# Altium project DSpico.PrjPcb
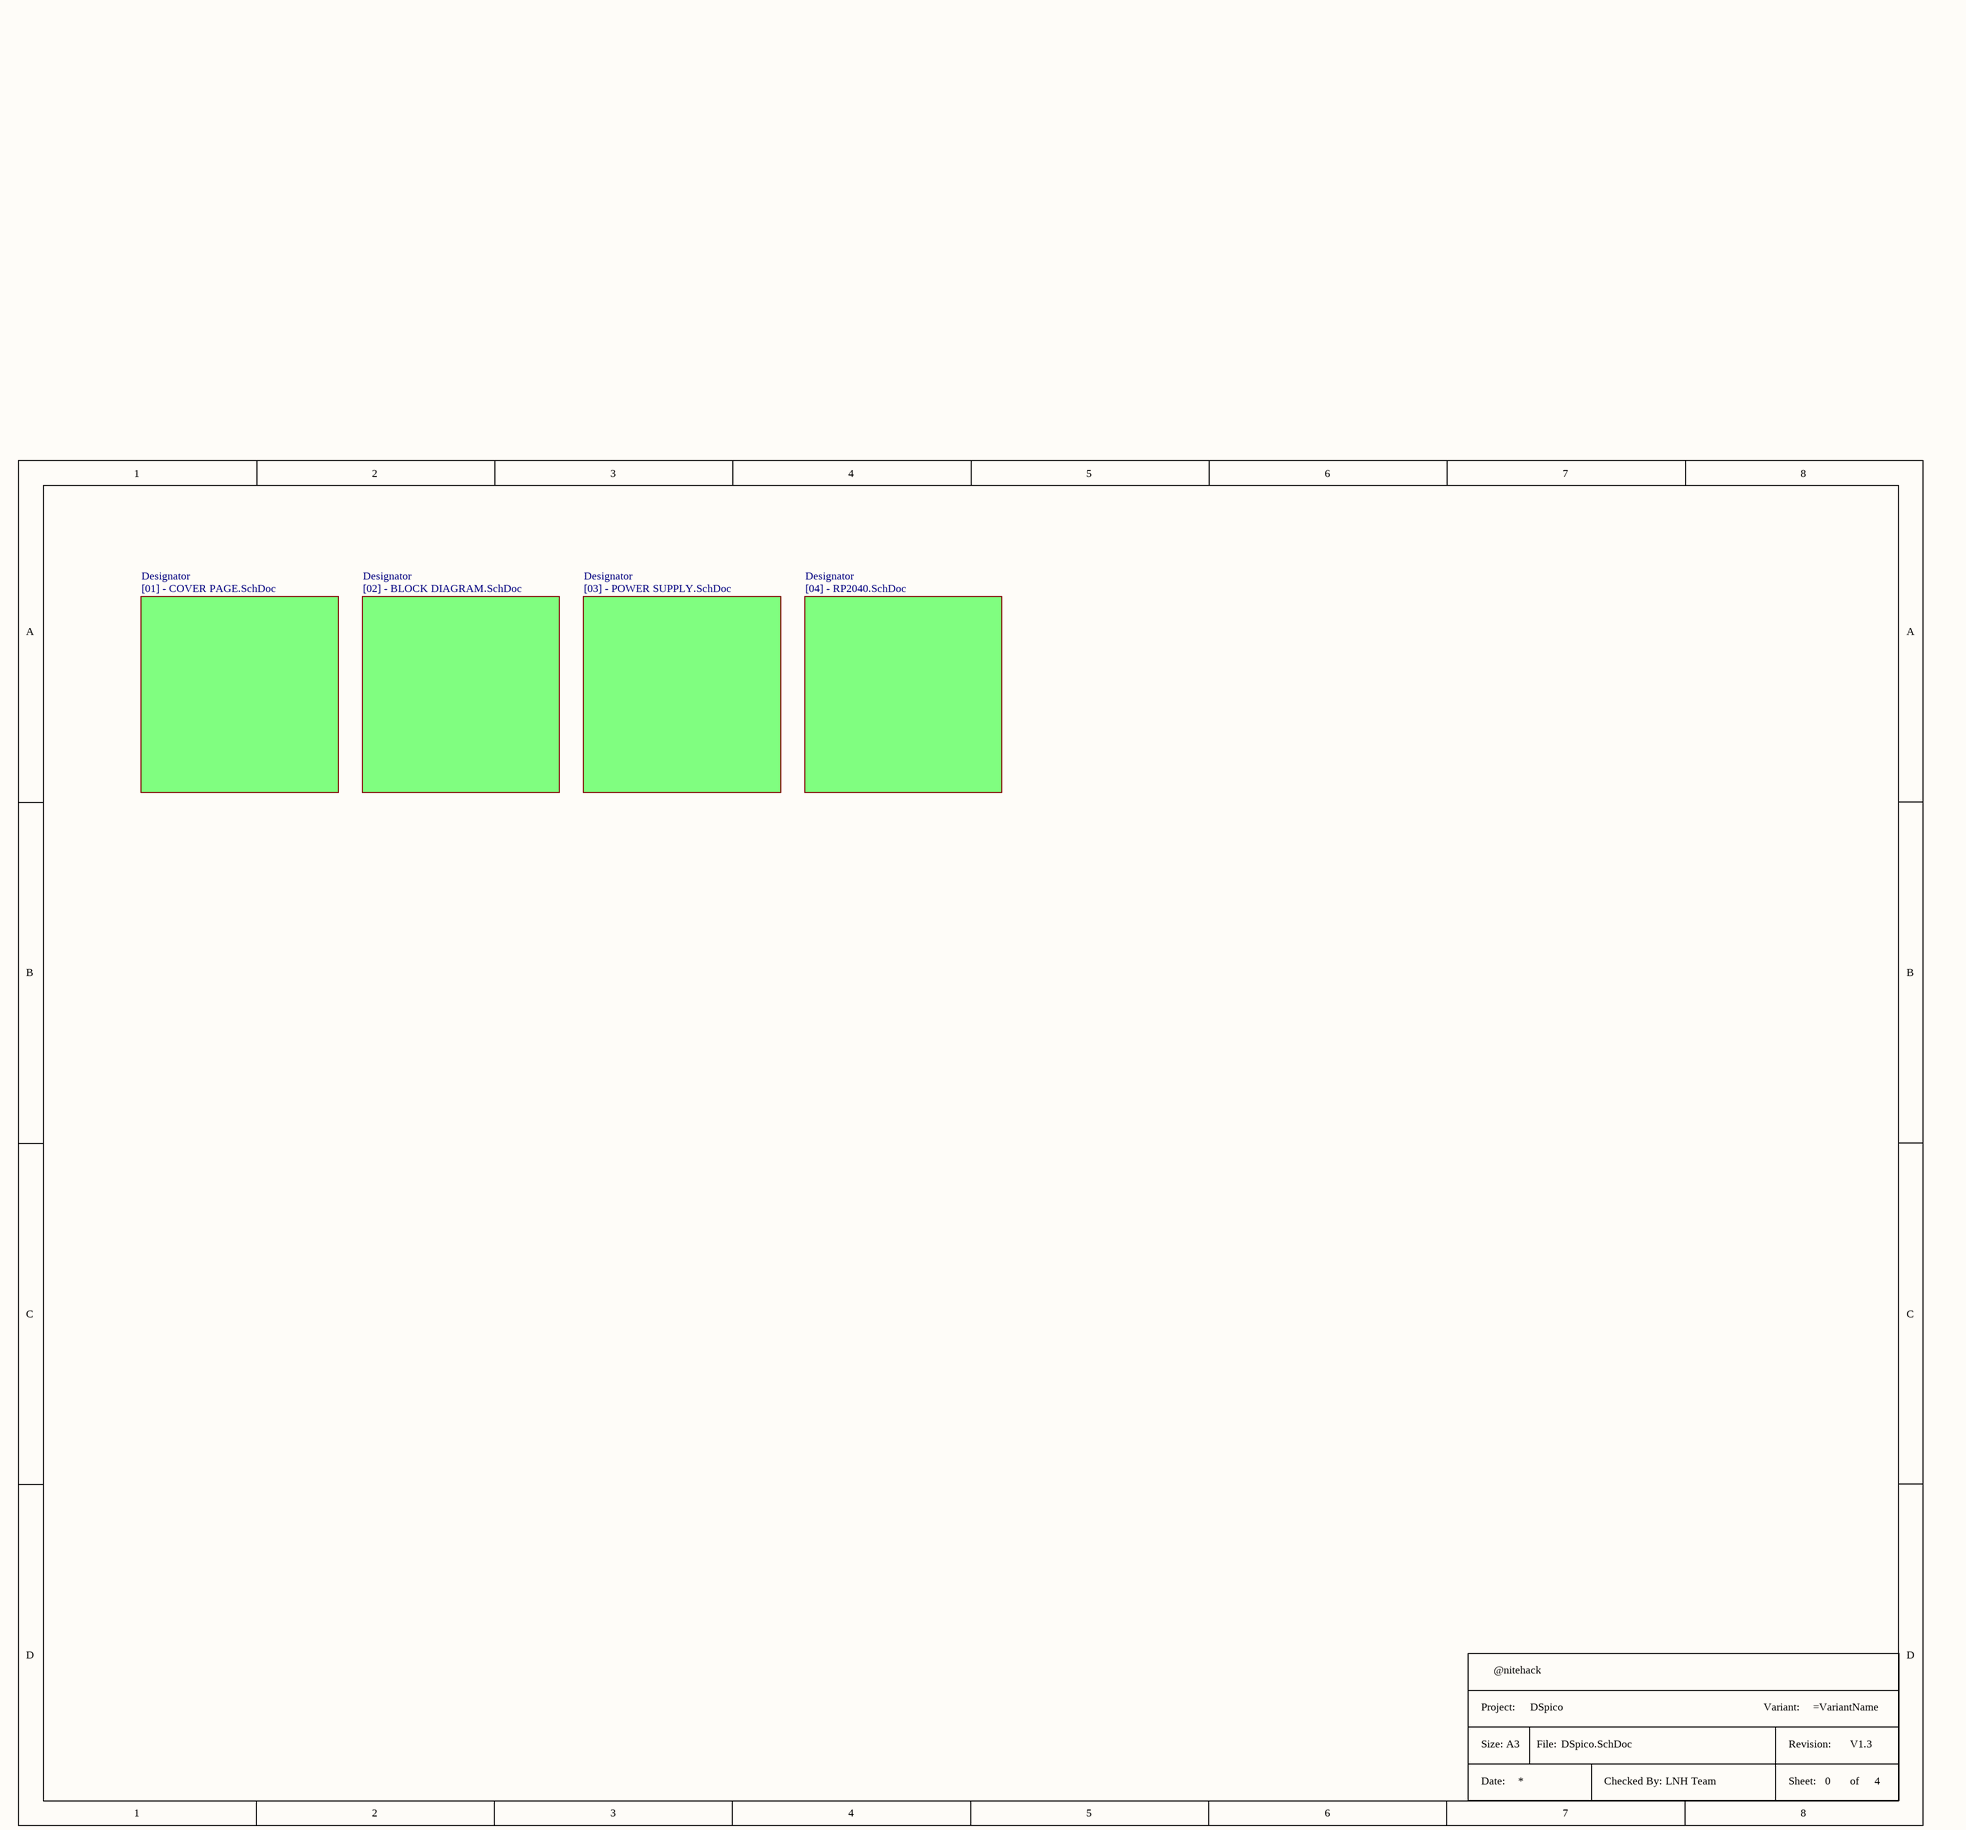
[diagram p0: DSpico.SchDoc]
CheckedBy: LNH Team; Year: 2024; VersionRevision: V1.3; Project: DSpico; Company: @nitehack
5 sheets, 49 parts. Net scope: global (net labels, ports and power ports of the same name join across sheets).
Board file: DSpico_PCB.PcbDoc
Sheets:
  DSpico.SchDoc
    Designator = [01] - COVER PAGE.SchDoc
    Designator = [03] - POWER SUPPLY.SchDoc
    Designator = [02] - BLOCK DIAGRAM.SchDoc
    Designator = [04] - RP2040.SchDoc

## Sheet DSpico.SchDoc
size A3; CompanyName: KDS; Organization: KDS; DocumentNumber: 0; Revision: V1I1; SheetNumber: 0; SheetTotal: 4; PageSetup: Record=PageOptions|CenterHorizontal=True|CenterVertical=True|PrintScale=1.07|XCorrection=1.00|YCorrection=1.00|PrintKind=1|BorderSize=5000000|LeftOffset=0|BottomOffset=0|Orientation=2|PaperLength=1000|PaperWidth=1000|Scale=100|PaperSource=7|PrintQuality=600|MediaType=1|DitherType=10|PaperKind=A3|PrintScaleMode=1; ProjectName: KDS C6A816x Module

### Parts
(Parts that share a designator on the sheet are numbered #1, #2 ... from top to bottom, then left to right.)
*#1  Title Block A3  (value not drawn)  (graphical)

### Sub-sheets
Designator = [01] - COVER PAGE.SchDoc: no entries
Designator = [03] - POWER SUPPLY.SchDoc: no entries
Designator = [02] - BLOCK DIAGRAM.SchDoc: no entries
Designator = [04] - RP2040.SchDoc: no entries

### Notes on the sheet
- (in symbol Title Block A3) Project:; Variant:; Size: A3; File:; Revision:; Date:; Checked By:; Sheet:; of

## Sheet [01] - COVER PAGE.SchDoc
size A3; DocumentNumber: 1; SheetNumber: 1; SheetTotal: 4
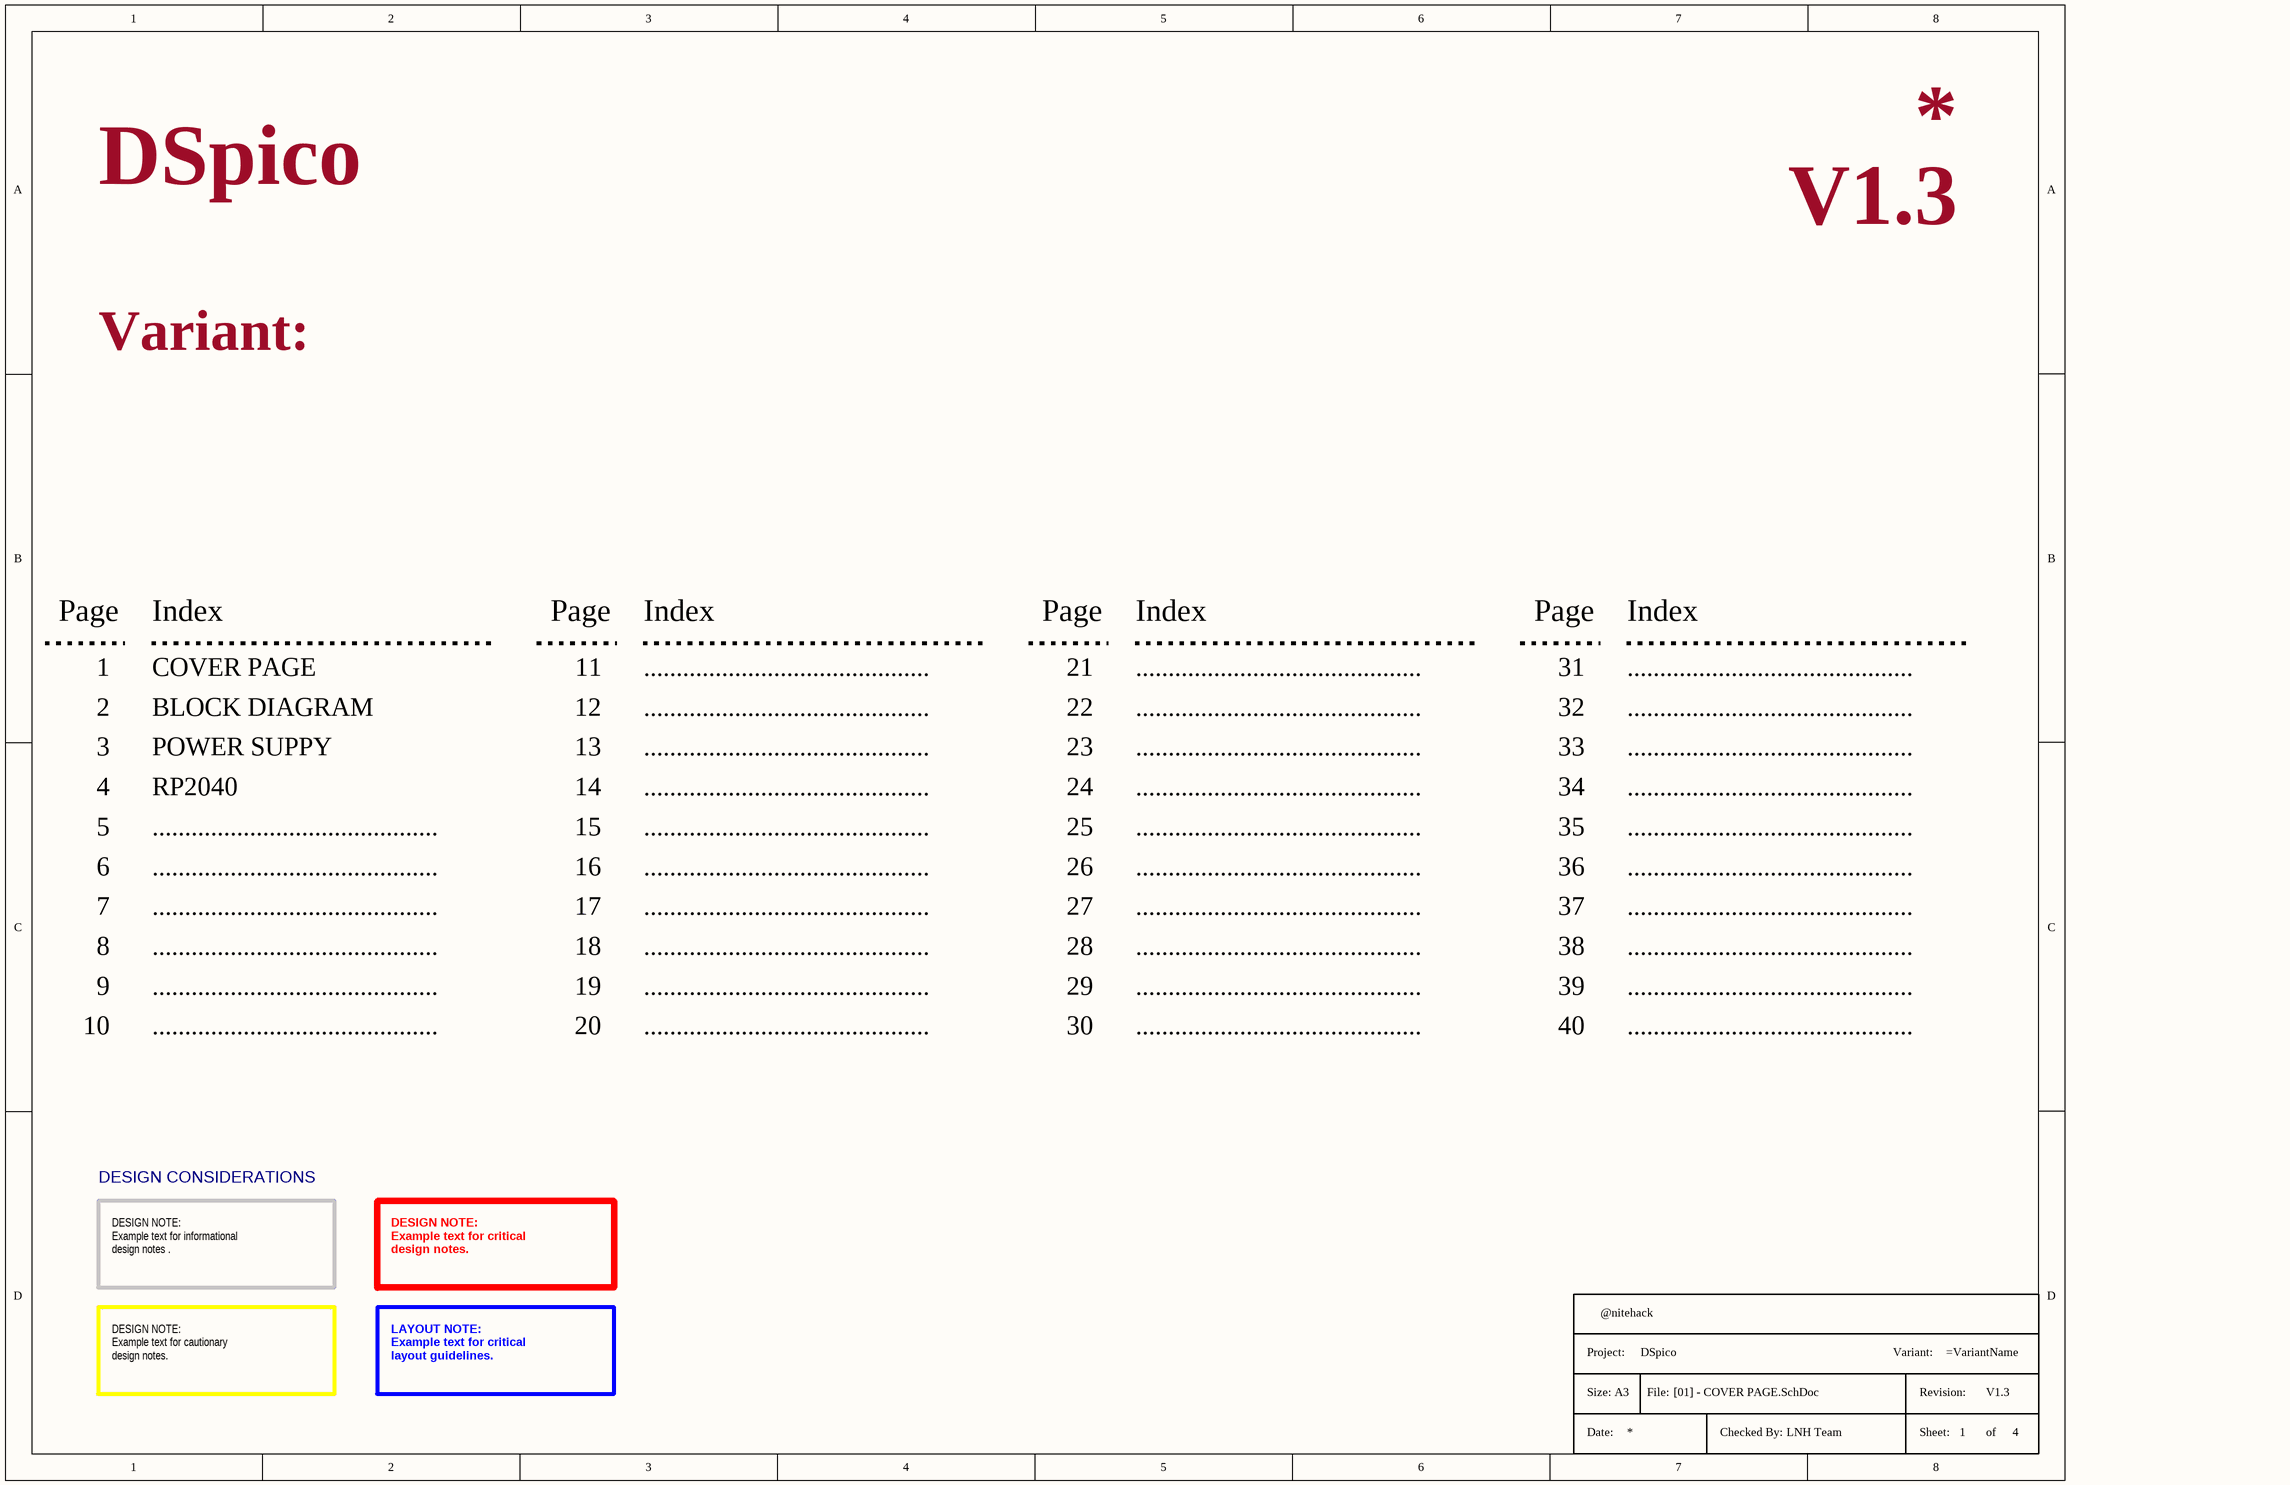
[diagram p1: [01] - COVER PAGE.SchDoc]

### Parts
(Parts that share a designator on the sheet are numbered #1, #2 ... from top to bottom, then left to right.)
*#2  Title Block A3  (value not drawn)  (graphical)

### Notes on the sheet
- Variant:
- Page
- Index
- 1
- COVER PAGE
- 11
- ............................................
- 21
- 31
- 2
- 3
- BLOCK DIAGRAM
- POWER SUPPY
- 12
- 13
- 22
- 23
- 32
- 33
- 4
- 5
- RP2040
- 14
- 15
- 24
- 25
- 34
- 35
- 6
- 16
- 26
- 36
- 7
- 8
- 17
- 18
- 27
- 28
- 37
- 38
- 9
- 10
- 19
- 20
- 29
- 30
- 39
- 40
- DESIGN CONSIDERATIONS
- DESIGN NOTE:
  Example text for informational
  design notes .
- DESIGN NOTE:
  Example text for critical
  design notes.
- DESIGN NOTE:
  Example text for cautionary
  design notes.
- LAYOUT NOTE:
  Example text for critical
  layout guidelines.
- (in symbol Title Block A3) Project:; Variant:; Size: A3; File:; Revision:; Date:; Checked By:; Sheet:; of

## Sheet [03] - POWER SUPPLY.SchDoc
size A4; DocumentNumber: 3; SheetNumber: 3; SheetTotal: 4
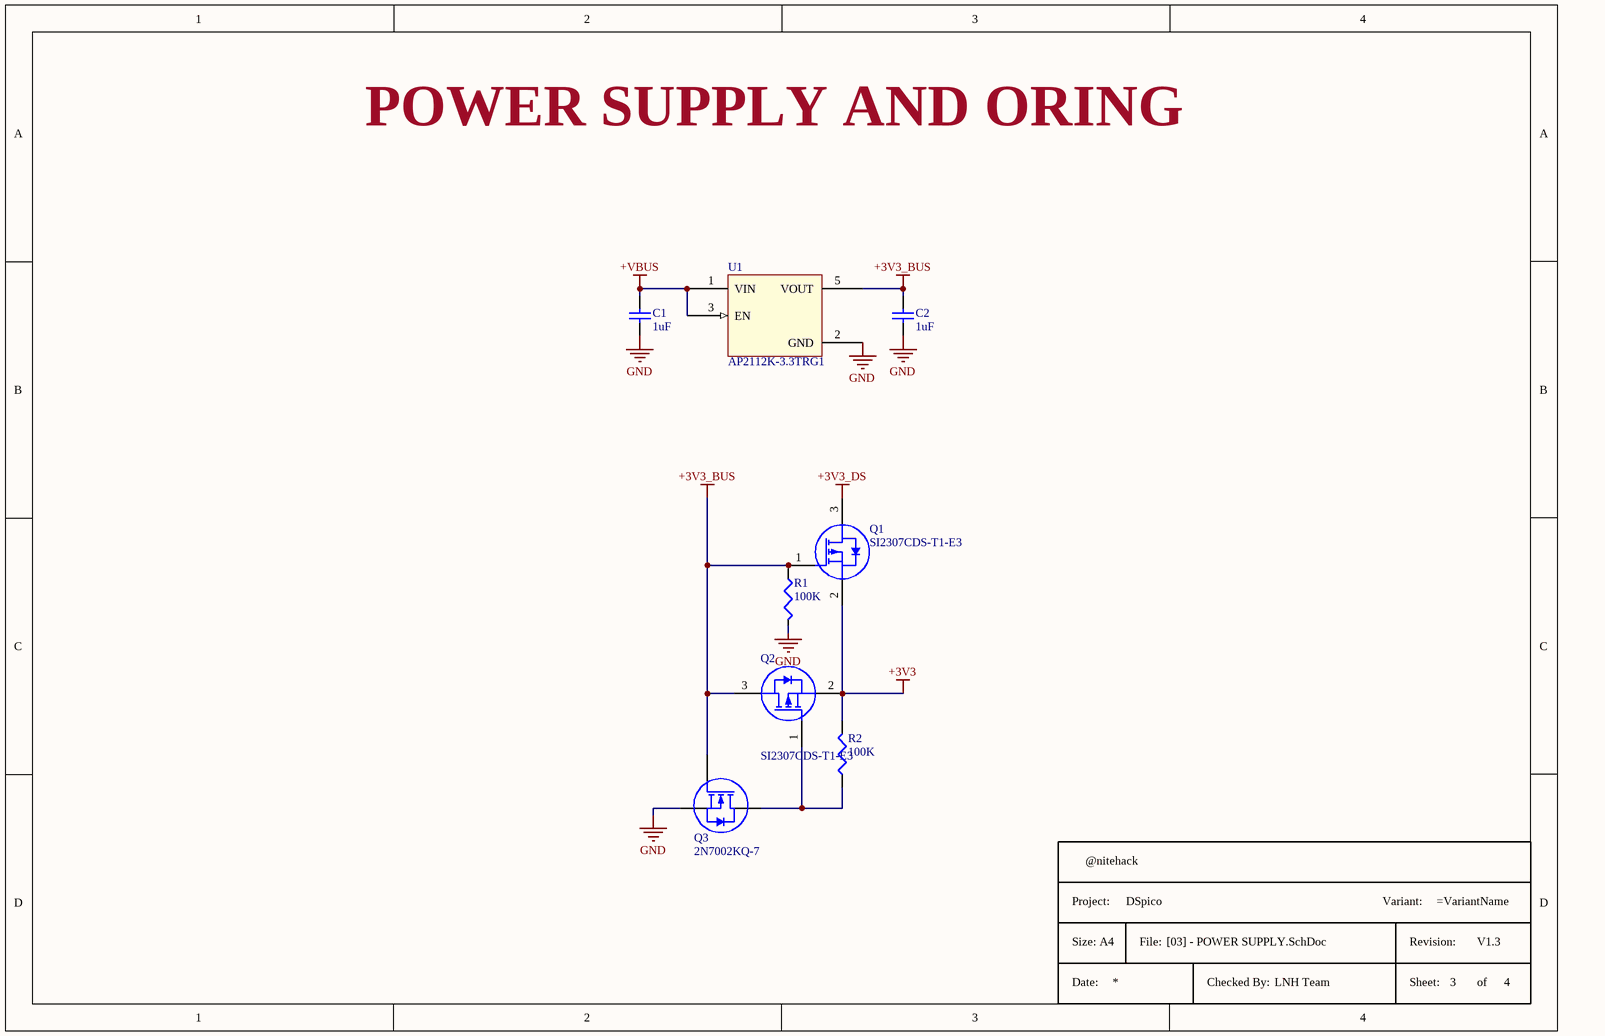
[diagram p2: [03] - POWER SUPPLY.SchDoc]

### Parts
*?  Title Block A4  (value not drawn)  (graphical)
C1  1uF  [C0402]
C2  1uF  [C0402]
Q1  SI2307CDS-T1-E3  [SOT-23_L2.9-W1.3-P1.90-LS2.4-BR]
Q2  SI2307CDS-T1-E3  [SOT-23_L2.9-W1.3-P1.90-LS2.4-BR]
Q3  2N7002KQ-7  [SOT-23_L2.9-W1.3-P1.90-LS2.4-BR]
R1  100K  [R0402]
R2  100K  [R0402]
U1  AP2112K-3.3TRG1  [SOT95P285X140-5N]

### Nets
+3V3: Q1.2(S) Q2.2(S) R2.2
+3V3_BUS: C2.2 Q1.1(G) Q2.3(D) Q3.1(G) R1.1 U1.5(VOUT)
+3V3_DS: Q1.3(D)
+VBUS: C1.2 U1.1(VIN) U1.3(EN)
GND: C1.1 C2.1 Q3.2(S) R1.2 U1.2(GND)
NetQ2_1: Q2.1(G) Q3.3(D) R2.1

### Notes on the sheet
- POWER SUPPLY AND ORING
- (in symbol Title Block A4) Project:; Variant:; Size: A4; File:; Revision:; Date:; Checked By:; Sheet:; of

### Library data of the parts
C1 C2 = C1005X5R1E105K050BC: TDK - C1005X5R1E105K050BC - COND, CERÁ MULT, X5R, 1UF, 25V, 0402; Dielectric Material: Ceramic; Tolerance: 10%; Supplier 1: Farnell; Supplier Part Number 1: 2346884; RoHS: YES; Stock: 131328; Pricing: 10=0,0948, 100=0,0638, 500=0,0468, 2500=0,0336, 5000=0,028, 10000=0,021, 50000=0,0175, 100000=0,0153 (EUR); ComponentLink1URL: http://www.farnell.com/datasheets/1796654.pdf; ComponentLink1Description: http://www.farnell.com/datasheets/1796654.pdf; .PCBCheck: *; .SCHCheck: *; Supplier 2: RSComponents; Supplier 3: Mouser; Supplier 4: Digi-Key; Supplier Part Number 2: 1110310; Supplier Part Number 3: 810-C1005X5R1E105K; Supplier Part Number 4: 445-9066-1-ND; Storage Location: C1-F2; Manufacturer: TDK; Manufacturer Part Number: C1005X5R1E105K050BC; Mount: Surface Mount; Case/Package: 0402; Weight: 2.3E-05oz; Case Code (Metric): 1005; Case Code (Imperial): 0402; Min Operating Temperature: -55°C; Max Operating Temperature: 85°C; Packaging: Tape and Reel; Capacitance: 1uF; Voltage Rating: 25V; Termination: SMD/SMT; Package Quantity: 1; Voltage Rating (DC): 25V; Dielectric: X5R; Composition: Ceramic; Length: 1mm; Height: 0.5mm; Width: 0.02inch; Thickness: 0.022inch; Depth: 0.5mm; Radiation Hardening: No; REACH SVHC: No SVHC; Lead Free: Lead Free
Q1 Q2 = SI2307CDS-T1-E3: P-Channel 30 V 3.5A (Tc) 1.1W (Ta), 1.8W (Tc) Surface Mount SOT-23-3 (TO-236); Number of Elements: 1; Package Body Material: Plastic; JEDEC-95 Code: TO-236AB; Transistor Application: SWITCHING; FET Technology: METAL-OXIDE SEMICONDUCTOR; Drain-source On Resistance-Max: 88mR; DS Breakdown Voltage-Min: 30V; Qualification Status: Not Qualified; Transistor Element Material: SILICON; Operating Mode: ENHANCEMENT MODE; Time @ Peak Reflow Temperature-Max (s): 30s; JESD-30 Code: R-PDSO-G3; Moisture Sensitivity Level: 1; Terminal Finish: Tin; Max Operating Temperature: 150°C; Power Dissipation-Max (Abs): 1.8W; Package Shape: Rectangular; Surface Mount: Yes; Case/Package: SOT23-3; JESD-609 Code: e3; Polarity/Channel Type: P-CHANNEL; Peak Reflow Temperature (Cel): 260°C; Terminal Position: DUAL; Drain Current-Max (Abs) (ID): 3.5A; REACH SVHC: Yes; RoHS Compliant: Yes; Package Style: SMALL OUTLINEMeter; Number of Pins: 3; Drain Current-Max (ID): 3.5A; Terminal Form: Gull Wing; Value: SI2307CDS-T1-E3
Q3 = 2N7002KQ-7: MOSFETs SOT-23; Manufacturer: Diodes Zetex; Rise Time: 3.4ns; Continuous Drain Current (ID): 380mA; Number of Elements: 1; Power Dissipation: 540mW; Turn-On Delay Time: 3.9ns; Turn-Off Delay Time: 15.7ns; Fall Time: 9.9ns; Gate to Source Voltage (Vgs): 20V; Supplier 1: Arrow Electronics; Manufacturer Part Number: 2N7002KQ-7; RoHS: Yes; Category: MOSFETs; Stock 1: 3000; Pricing 1: 1=0,05830, 10=0,05770, 25=0,05710, 100=0,05650, 250=0,05600, 500=0,05540, 1000=0,05490, 3000=0,02680 (USD); Mount: Surface Mount; Case/Package: SOT-23; Number of Pins: 3; Contact Plating: Tin,Matte; Min Operating Temperature: -55°C; Max Operating Temperature: 150°C; Packaging: Tape and Reel; Radiation Hardening: No; Reach SVHC Compliant: Yes; RoHS Compliant: Yes; ComponentLink1URL: https://datasheet.ciiva.com/30023/ds30896-30023832.pdf?src-supplier=Avnet; ComponentLink1Description: https://datasheet.ciiva.com/30023/ds30896-30023832.pdf?src-supplier=Avnet; Supplier Part Number 1: 2N7002KQ-7
R1 R2 = CRCW0402100KFKED: RES SMD 100K OHM 1% 1/16W 0402; Manufacturer: Vishay; Resistance: 100kR; Temperature Coefficient: 100ppm/°C; Power Rating: 63mW; Voltage Rating: 50V; Supplier 1: Farnell; Manufacturer Part Number: CRCW0402100KFKED; Stock 1: 168772; Pricing 1: 10=0.0216, 100=0.0151, 500=0.0077, 2500=0.0058, 5000=0.0046 (GBP); Mount: Surface Mount; Case/Package: 0402; Number of Pins: 2; Weight: 2.3E-05oz; Contact Plating: Tin; Case Code (Metric): 1005; Case Code (Imperial): 0402; Min Operating Temperature: -55°C; Max Operating Temperature: 155°C; Tolerance: 1%; Composition: Thick Film; Termination: SMD/SMT; Packaging: Tape and Reel; Package Quantity: 10000; Number of Terminations: 2; Max Power Dissipation: 63mW; Voltage Rating (DC): 50V; Military Standard: Not; Length: 1mm; Height: 0.35mm; Width: 0.02inch; Depth: 0.5mm; Radiation Hardening: No; Lead Free: Lead Free; REACH SVHC: Unknown; ComponentLink1URL: https://datasheet.ciiva.com/11810/0900766b80d98824-11810752.pdf; ComponentLink1Description: https://datasheet.ciiva.com/11810/0900766b80d98824-11810752.pdf; ComponentLink2URL: https://datasheet.ciiva.com/26316/fld-crcw-e3-data-en-26316630.pdf; ComponentLink2Description: https://datasheet.ciiva.com/26316/fld-crcw-e3-data-en-26316630.pdf; ComponentLink3URL: https://datasheet.ciiva.com/2463/dcrcwe3-2463064.pdf; ComponentLink3Description: https://datasheet.ciiva.com/2463/dcrcwe3-2463064.pdf; ComponentLink4URL: https://datasheet.ciiva.com/2463/dcrcwe3-2463065.pdf; ComponentLink4Description: https://datasheet.ciiva.com/2463/dcrcwe3-2463065.pdf; ComponentLink5URL: https://datasheet.ciiva.com/16776/70201119-16776281.pdf; ComponentLink5Description: https://datasheet.ciiva.com/16776/70201119-16776281.pdf; ComponentLink6URL: https://datasheet.ciiva.com/16941/dcrcwe3-16941129.pdf; ComponentLink6Description: https://datasheet.ciiva.com/16941/dcrcwe3-16941129.pdf; ComponentLink7URL: https://datasheet.ciiva.com/2463/dcrcwe3-2463066.pdf; ComponentLink7Description: https://datasheet.ciiva.com/2463/dcrcwe3-2463066.pdf; ComponentLink8URL: https://datasheet.ciiva.com/3255/dcrcwe3-3255947.pdf; ComponentLink8Description: https://datasheet.ciiva.com/3255/dcrcwe3-3255947.pdf; ComponentLink9URL: https://datasheet.ciiva.com/3255/dcrcwe3-3255948.pdf; ComponentLink9Description: https://datasheet.ciiva.com/3255/dcrcwe3-3255948.pdf; ComponentLink10URL: https://datasheet.ciiva.com/16208/dcrcwe3-16208508.pdf; ComponentLink10Description: https://datasheet.ciiva.com/16208/dcrcwe3-16208508.pdf; ComponentLink11URL: https://datasheet.ciiva.com/5546/dcrcwe3-109170-5546638.pdf; ComponentLink11Description: https://datasheet.ciiva.com/5546/dcrcwe3-109170-5546638.pdf; ComponentLink12URL: https://datasheet.ciiva.com/46441/1720486-46441598.pdf; ComponentLink12Description: https://datasheet.ciiva.com/46441/1720486-46441598.pdf; Supplier Part Number 1: 1469671; Supplier 2: RSComponents; Supplier 3: Mouser; Supplier 4: Digi-Key; Supplier Part Number 2: 6784684; Supplier Part Number 3: 71-CRCW0402-100K-E3; Supplier Part Number 4: 541-100KLCT-ND; Storage Location: C5-K3
U1 = AP2112K-3.3TRG1: IC REG LDO 3.3V 0.6A SOT25; Manufacturer: Diodes; Min Input Voltage: 2.5V; Number of Outputs: 1; Dropout Voltage: 250mV; Max Input Voltage: 6V; Output Current: 600mA; Quiescent Current: 55uA; Polarity: Positive; Accuracy: 1.5%; Output Type: Fixed; Supplier 1: Future Electronics; Manufacturer Part Number: AP2112K-3.3TRG1; RoHS: Yes; Category: Voltage Regulators - Linear; Stock 1: 456000; Pricing 1: 3000=0,12700, 9000=0,12400, 15000=0,12200, 60000=0,11800, 90000=0,11500 (USD); Mount: Surface Mount; Case/Package: SOT-23-5; Number of Pins: 5; Min Operating Temperature: -40°C; Max Operating Temperature: 85°C; Package Quantity: 1; Packaging: Tape and Reel; Output Voltage: 3.3V; Number of Regulators: 1; Max Output Current: 600mA; Length: 3.1mm; Width: 1.7mm; Height: 1.3mm; Lead Free: Lead Free; RoHS Compliant: Yes; ComponentLink1URL: https://datasheet.ciiva.com/30016/ap2112-30016792.pdf?src-supplier=Avnet; ComponentLink1Description: https://datasheet.ciiva.com/30016/ap2112-30016792.pdf?src-supplier=Avnet; ComponentLink2URL: https://datasheet.ciiva.com/29569/ap2112-29569918.pdf?src-supplier=Digi-Key; ComponentLink2Description: https://datasheet.ciiva.com/29569/ap2112-29569918.pdf?src-supplier=Digi-Key; ComponentLink3URL: https://datasheet.ciiva.com/29569/ap2112-29569919.pdf?src-supplier=Digi-Key; ComponentLink3Description: https://datasheet.ciiva.com/29569/ap2112-29569919.pdf?src-supplier=Digi-Key; ComponentLink4URL: https://datasheet.ciiva.com/29569/ap2112-29569917.pdf?src-supplier=Digi-Key; ComponentLink4Description: https://datasheet.ciiva.com/29569/ap2112-29569917.pdf?src-supplier=Digi-Key; Supplier Part Number 1: 8043011

## Sheet [02] - BLOCK DIAGRAM.SchDoc
size A3; DocumentNumber: 2; SheetNumber: 2; SheetTotal: 4
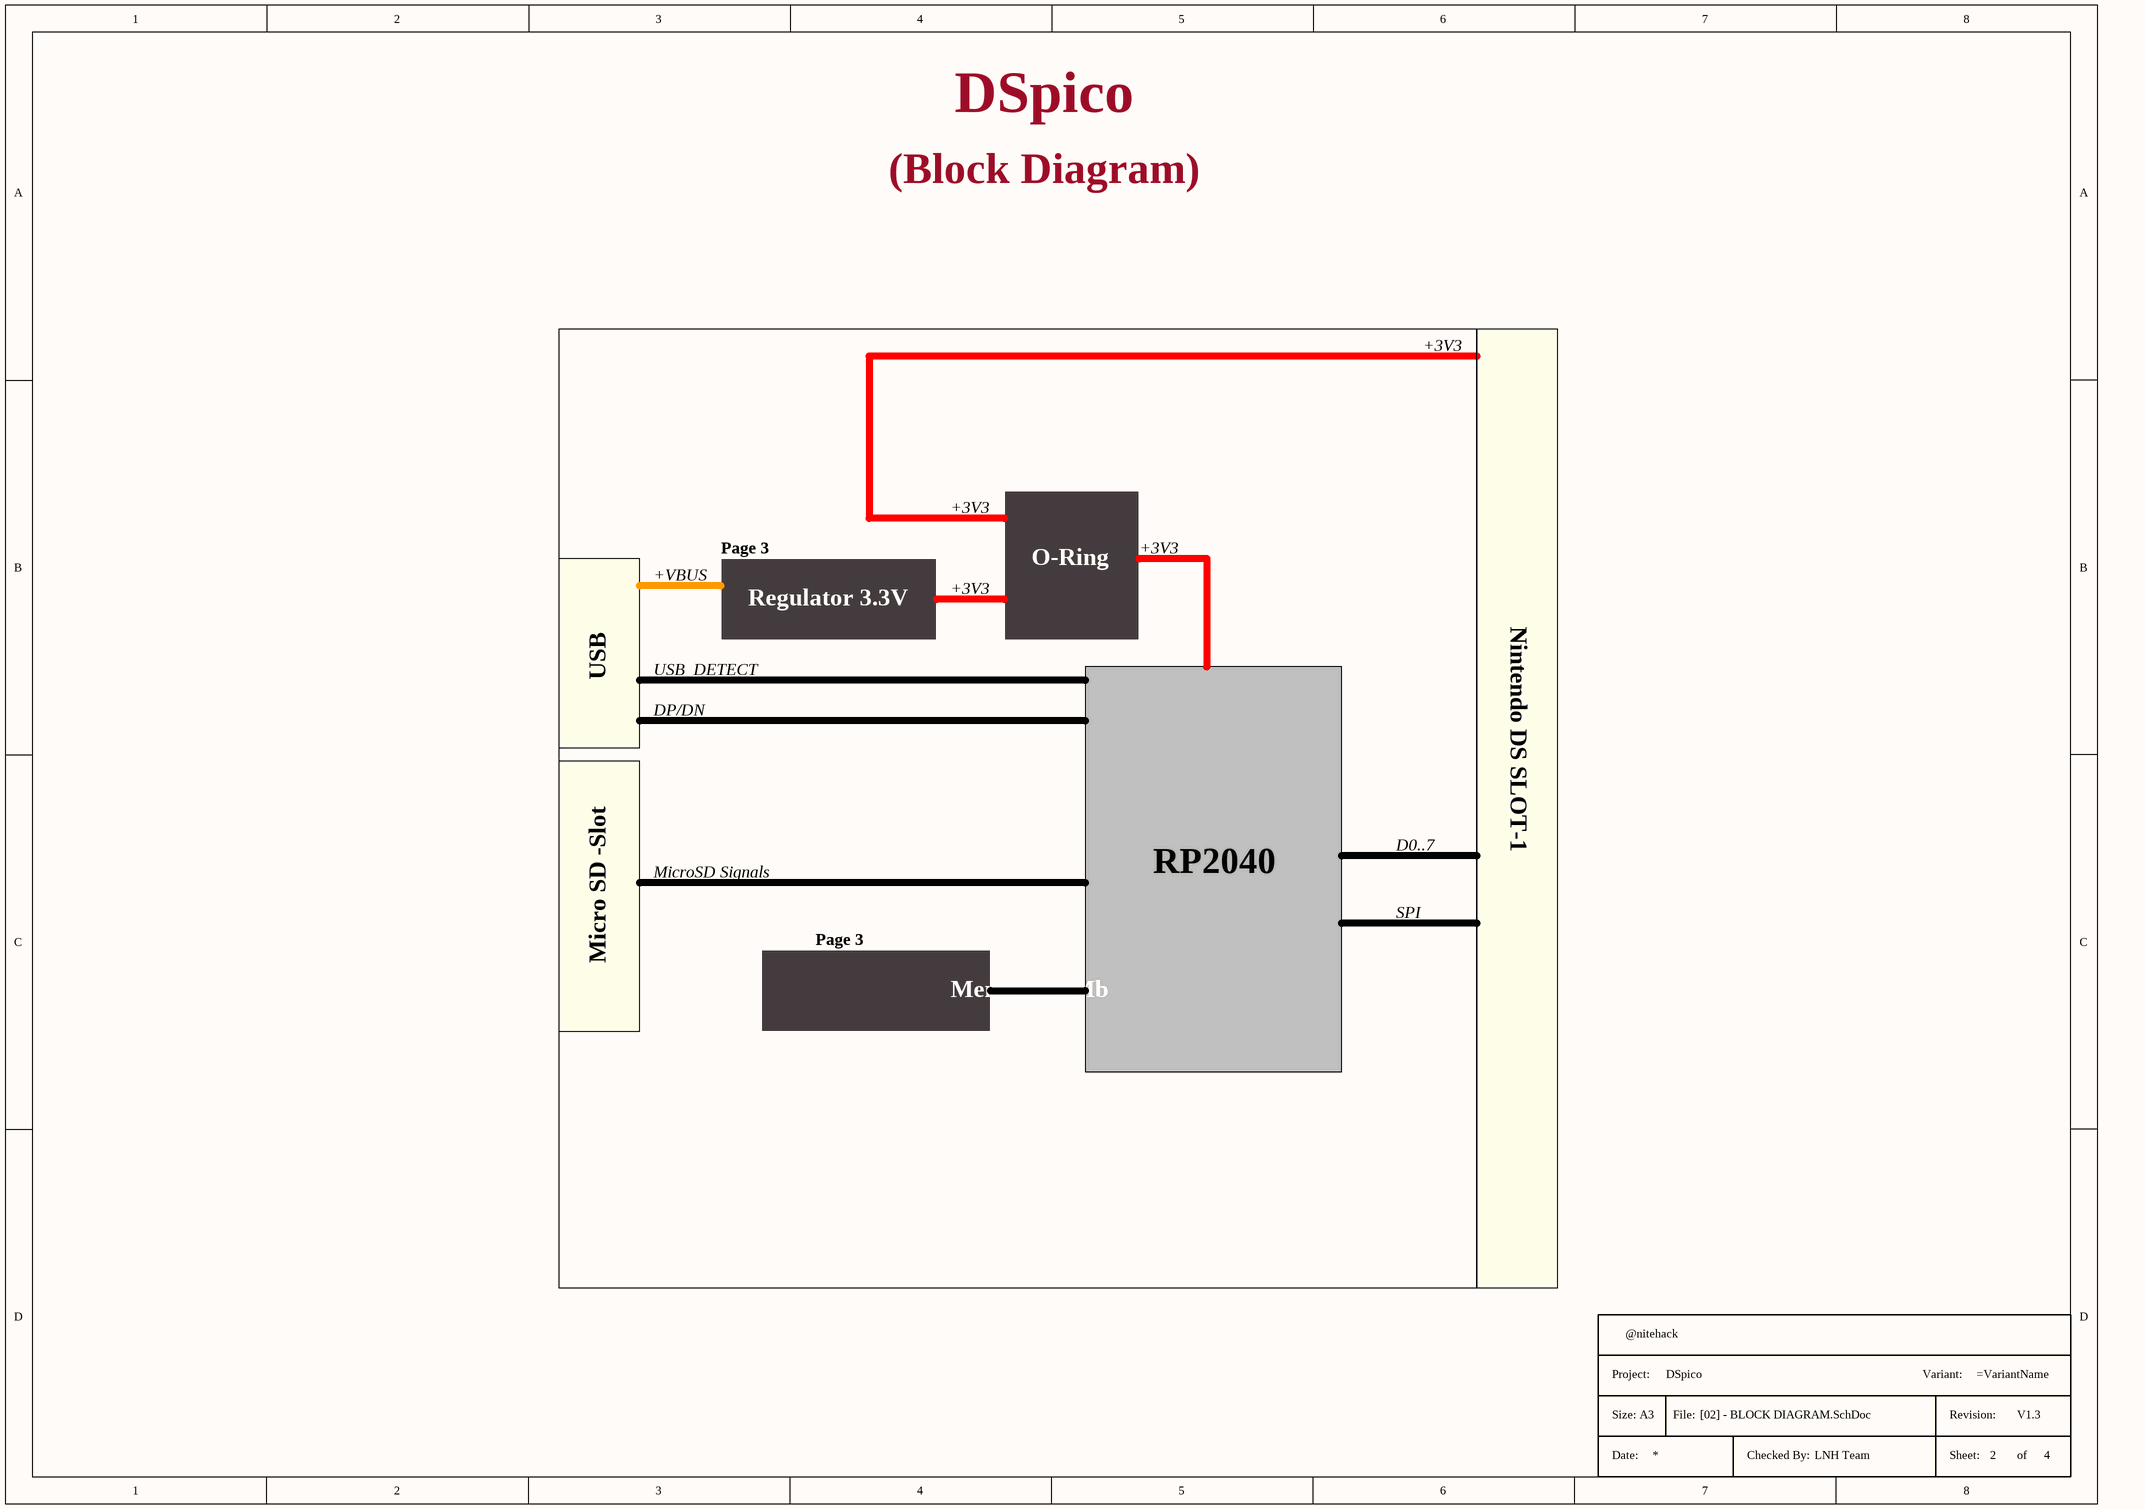
[diagram p3: [02] - BLOCK DIAGRAM.SchDoc]

### Parts
(Parts that share a designator on the sheet are numbered #1, #2 ... from top to bottom, then left to right.)
*#3  Title Block A3  (value not drawn)  (graphical)

### Notes on the sheet
- (Block Diagram)
- +3V3
- +VBUS
- Page 3
- O-Ring
- Regulator 3.3V
- Nintendo DS SLOT-1
- USB
- DP/DN
- USB_DETECT
- D0..7
- MicroSD Signals
- RP2040
- SPI
- Micro SD -Slot
- Memory 16Mb
- (in symbol Title Block A3) Project:; Variant:; Size: A3; File:; Revision:; Date:; Checked By:; Sheet:; of

## Sheet [04] - RP2040.SchDoc
size A3; DocumentNumber: 4; SheetNumber: 4; SheetTotal: 4
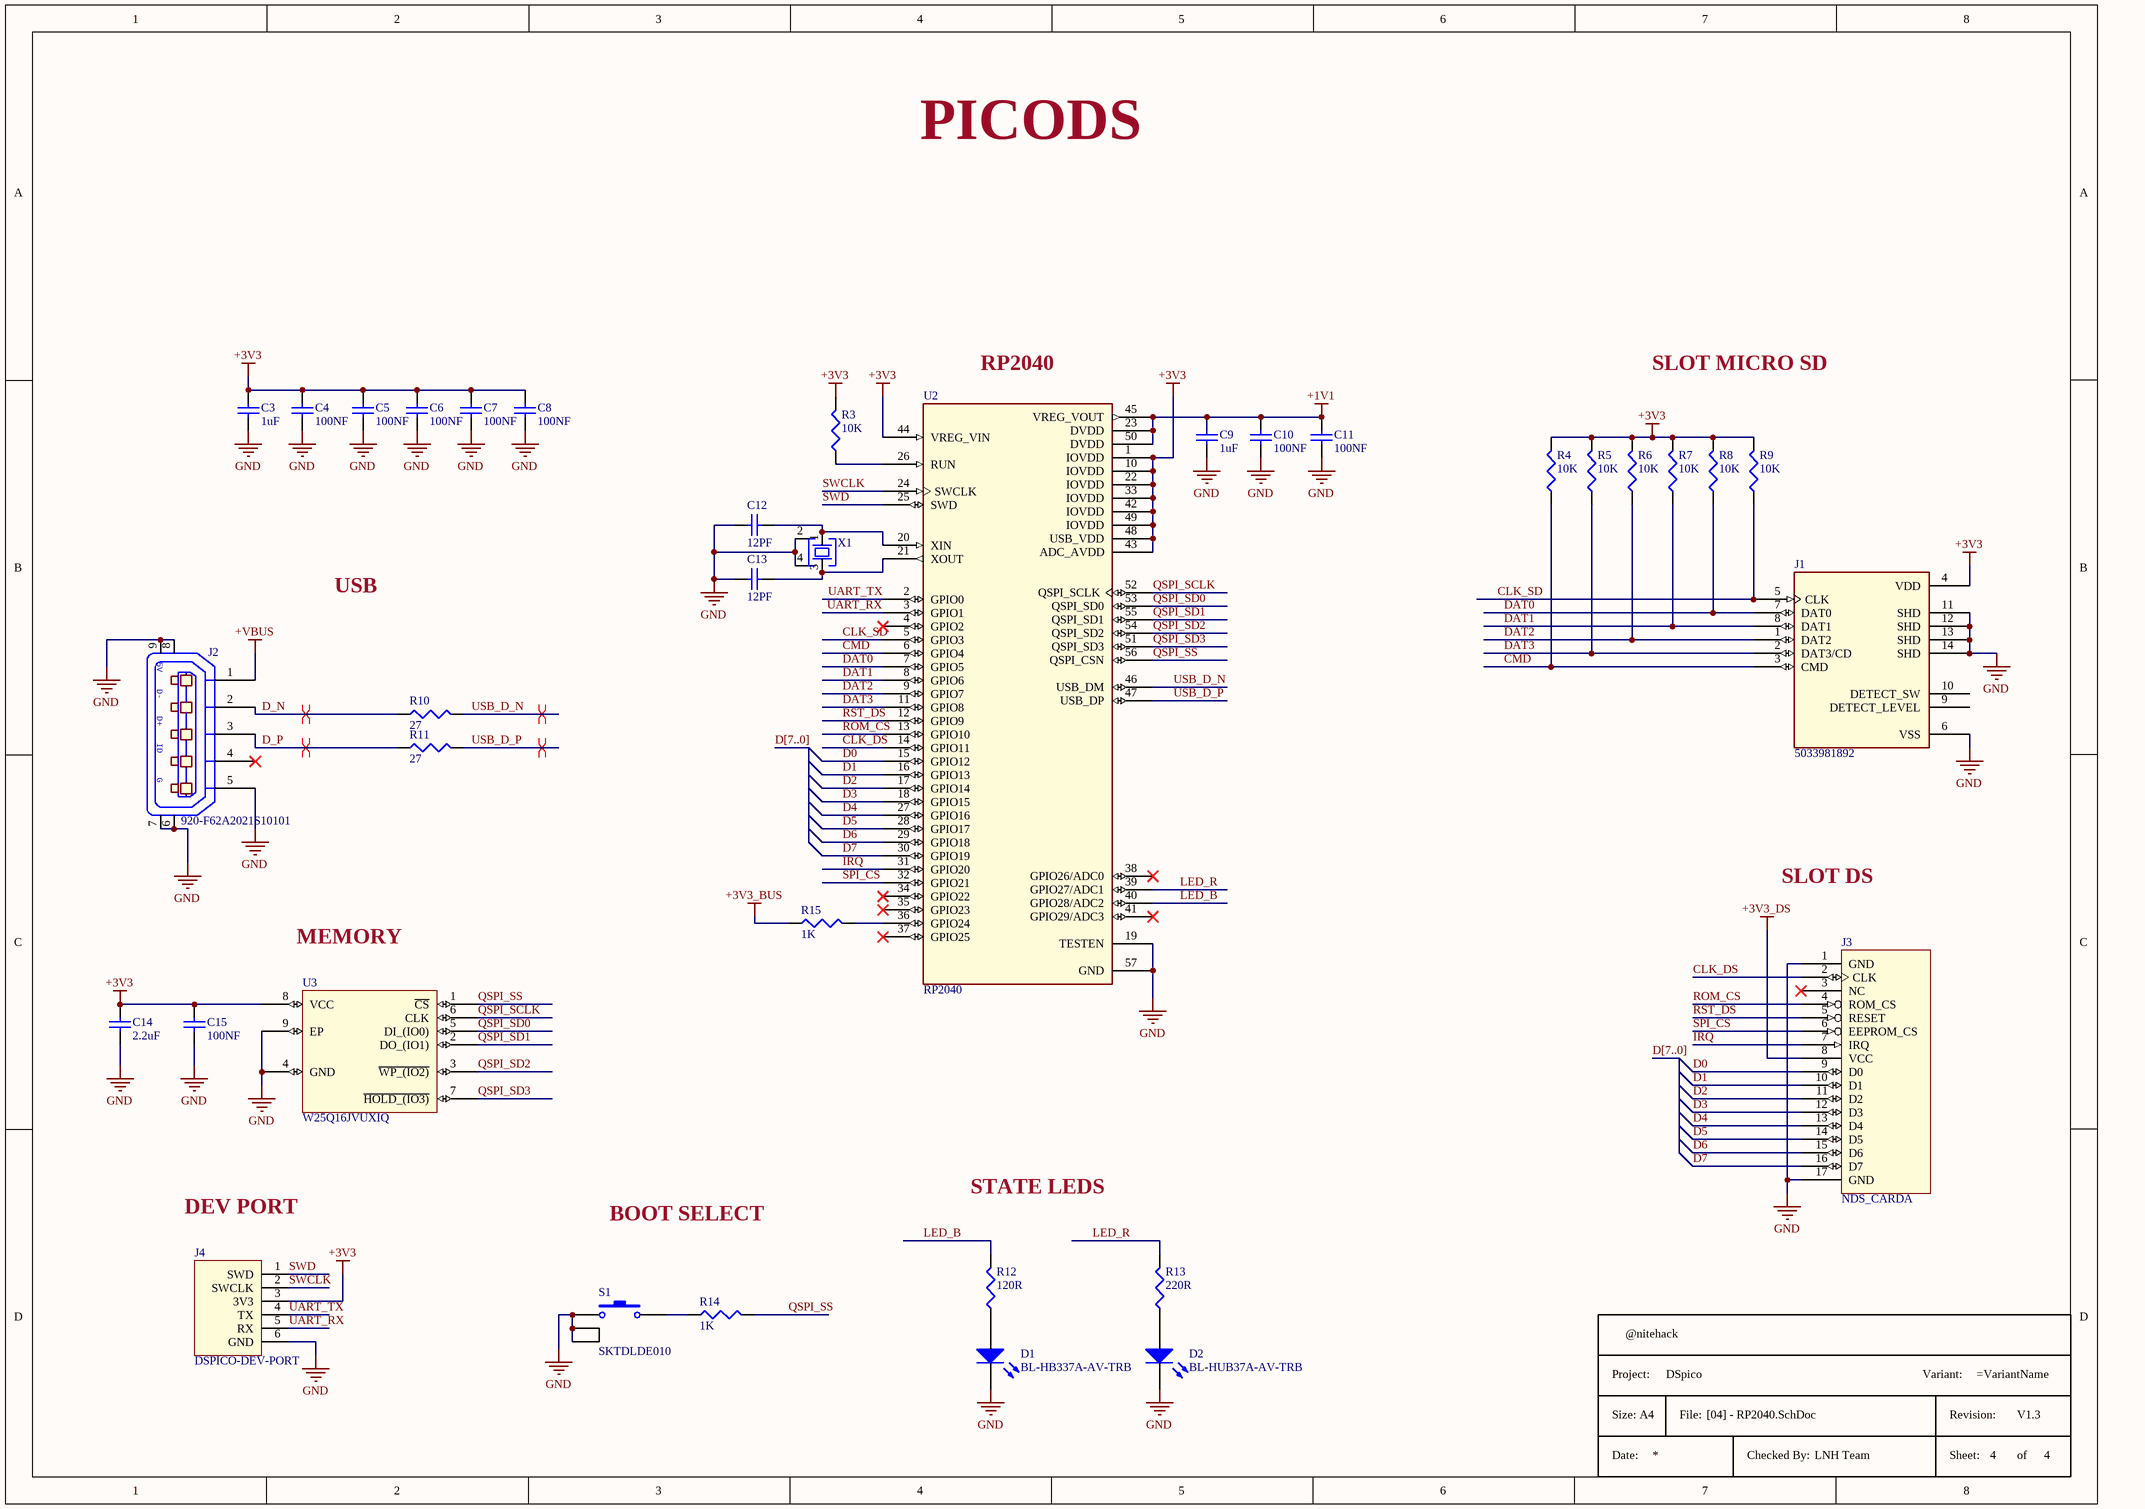
[diagram p4: [04] - RP2040.SchDoc]

### Parts
(Parts that share a designator on the sheet are numbered #1, #2 ... from top to bottom, then left to right.)
*#4  Title Block A4  (value not drawn)  (graphical)
C3  1uF  [C0402]
C4  100NF  [C0402]
C5  100NF  [C0402]
C6  100NF  [C0402]
C7  100NF  [C0402]
C8  100NF  [C0402]
C9  1uF  [C0402]
C10  100NF  [C0402]
C11  100NF  [C0402]
C12  12PF  [C0402]
C13  12PF  [C0402]
C14  2.2uF  [C0402]
C15  100NF  [C0402]
D1  BL-HB337A-AV-TRB  [LED0402-RD]
D2  BL-HUB37A-AV-TRB  [LED0402-RD]
J1  5033981892  [503398-1892_MOL]
J2  920-F62A2021S10101  [MICRO-USB_MICRO-USB-31]
J3  NDS_CARDA  [NDS_CARD]  (no BOM)
J4  DSPICO-DEV-PORT  [EP_DEV_PORT]  (no BOM)
R3  10K  [R0402]
R4  10K  [R0402]
R5  10K  [R0402]
R6  10K  [R0402]
R7  10K  [R0402]
R8  10K  [R0402]
R9  10K  [R0402]
R10  value 27  [R0402]  (hidden comment: RC0402FR-0727RL)
R11  value 27  [R0402]  (hidden comment: RC0402FR-0727RL)
R12  120R  [R0402]
R13  220R  [R0402]
R14  1K  [R0402]
R15  1K  [R0402]
S1  SKTDLDE010  [KEY-SMD_SKTDLDE010]
U2  RP2040  [QFN40P700X700X90-57N]
U3  W25Q16JVUXIQ  [SON50P300X200X60-9N]
X1  XYDBPCNANF-12MHZ  [OSC-SMD_4P-L2.5-W2.0-BL]  (value not drawn)

### Nets
+1V1: C9.2 C10.2 C11.2 U2.23(DVDD) U2.45(VREG_VOUT) U2.50(DVDD)
+3V3: C3.2 C4.2 C5.2 C6.2 C7.2 C8.2 C14.2 C15.2 J1.4(VDD) J4.3(3V3) R3.2 R4.2 R5.2 R6.2 R7.2 R8.2 R9.2 U2.1(IOVDD) U2.10(IOVDD) U2.22(IOVDD) U2.33(IOVDD) U2.42(IOVDD) U2.43(ADC_AVDD) U2.44(VREG_VIN) U2.48(USB_VDD) U2.49(IOVDD) U3.8(VCC)
+3V3_BUS: R15.1
+3V3_DS: J3.8(VCC)
+VBUS: J2.1(P1)
GND: C3.1 C4.1 C5.1 C6.1 C7.1 C8.1 C9.1 C10.1 C11.1 C12.1 C13.1 C14.1 C15.1 D1.1 D2.1 J1.6(VSS) J1.11(SHD) J1.12(SHD) J1.13(SHD) J1.14(SHD) J2.5(P5) J2.6 J2.7 J2.8 J2.9 J3.1(GND) J3.17(GND) J4.6(GND) S1.1 S1.3 S1.4 U2.19(TESTEN) U2.57(GND) U3.4(GND) U3.9(EP) X1.2 X1.4
CLK_DS: J3.2(CLK) U2.14(GPIO11)
CLK_SD: J1.5(CLK) R9.1 U2.5(GPIO3)
CMD: J1.3(CMD) R4.1 U2.6(GPIO4)
D0: J3.9(D0) U2.15(GPIO12)
D1: J3.10(D1) U2.16(GPIO13)
D2: J3.11(D2) U2.17(GPIO14)
D3: J3.12(D3) U2.18(GPIO15)
D4: J3.13(D4) U2.27(GPIO16)
D5: J3.14(D5) U2.28(GPIO17)
D6: J3.15(D6) U2.29(GPIO18)
D7: J3.16(D7) U2.30(GPIO19)
D_N: J2.2(P2) R10.1
D_P: J2.3(P3) R11.1
DAT0: J1.7(DAT0) R8.1 U2.7(GPIO5)
DAT1: J1.8(DAT1) R7.1 U2.8(GPIO6)
DAT2: J1.1(DAT2) R6.1 U2.9(GPIO7)
DAT3: J1.2(DAT3/CD) R5.1 U2.11(GPIO8)
IRQ: J3.7(IRQ) U2.31(GPIO20)
LED_B: R12.2 U2.40(GPIO28/ADC2)
LED_R: R13.2 U2.39(GPIO27/ADC1)
QSPI_SCLK: U2.52(QSPI_SCLK) U3.6(CLK)
QSPI_SD0: U2.53(QSPI_SD0) U3.5(DI_(IO0))
QSPI_SD1: U2.55(QSPI_SD1) U3.2(DO_(IO1))
QSPI_SD2: U2.54(QSPI_SD2) U3.3(~{WP_(IO2)})
QSPI_SD3: U2.51(QSPI_SD3) U3.7(~{HOLD_(IO3)})
QSPI_SS: R14.2 U2.56(QSPI_CSN) U3.1(~{CS})
ROM_CS: J3.4(ROM_CS) U2.13(GPIO10)
RST_DS: J3.5(RESET) U2.12(GPIO9)
SPI_CS: J3.6(EEPROM_CS) U2.32(GPIO21)
SWCLK: J4.2(SWCLK) U2.24(SWCLK)
SWD: J4.1(SWD) U2.25(SWD)
UART_RX: J4.5(RX) U2.3(GPIO1)
UART_TX: J4.4(TX) U2.2(GPIO0)
USB_D_N: R10.2 U2.46(USB_DM)
USB_D_P: R11.2 U2.47(USB_DP)
NetC12_2: C12.2 U2.20(XIN) X1.1
NetC13_2: C13.2 U2.21(XOUT) X1.3
NetD1_2: D1.2 R12.1
NetD2_2: D2.2 R13.1
NetR3_1: R3.1 U2.26(RUN)
NetR14_1: R14.1 S1.2
NetR15_2: R15.2 U2.36(GPIO24)

Not connected (* = marked no-connect by the designer): J1 9(DETECT_LEVEL) 10(DETECT_SW); J2 4(P4)*; J3 3(NC)*; U2 4(GPIO2)* 34(GPIO22)* 35(GPIO23)* 37(GPIO25)* 38(GPIO26/ADC0)* 41(GPIO29/ADC3)*

### Buses and harness runs
bus D[7..0]

### Layout directives
differential pair: D_N, D_P, USB_D_N, USB_D_P

### Notes on the sheet
- PICODS
- (near U2) RP2040
- SLOT MICRO SD
- USB
- SLOT DS
- MEMORY
- DEV PORT
- BOOT SELECT
- STATE LEDS
- (in symbol 920-F62A2021S10101) 5V; D-; D+; ID; G
- (in symbol Title Block A4) Project:; Variant:; Size: A4; File:; Revision:; Date:; Checked By:; Sheet:; of

### Library data of the parts
C3 C9 = C1005X5R1E105K050BC: as C1 on sheet [03] - POWER SUPPLY; Supplier 1: Farnell; Supplier Part Number 1: 2346884; RoHS: YES; Stock: 131328; Pricing: 10=0,0948, 100=0,0638, 500=0,0468, 2500=0,0336, 5000=0,028, 10000=0,021, 50000=0,0175, 100000=0,0153 (EUR); ComponentLink1URL: http://www.farnell.com/datasheets/1796654.pdf; ComponentLink1Description: http://www.farnell.com/datasheets/1796654.pdf; .PCBCheck: *; .SCHCheck: *; Supplier 2: RSComponents; Supplier 3: Mouser; Supplier 4: Digi-Key; Supplier Part Number 2: 1110310; Supplier Part Number 3: 810-C1005X5R1E105K; Supplier Part Number 4: 445-9066-1-ND; Storage Location: C1-F2; Manufacturer: TDK; Manufacturer Part Number: C1005X5R1E105K050BC; Mount: Surface Mount; Case/Package: 0402; Weight: 2.3E-05oz; Case Code (Metric): 1005; Case Code (Imperial): 0402; Min Operating Temperature: -55°C; Max Operating Temperature: 85°C; Packaging: Tape and Reel; Capacitance: 1uF; Voltage Rating: 25V; Termination: SMD/SMT; Package Quantity: 1; Voltage Rating (DC): 25V; Dielectric: X5R; Composition: Ceramic; Length: 1mm; Height: 0.5mm; Width: 0.02inch; Thickness: 0.022inch; Depth: 0.5mm; Radiation Hardening: No; REACH SVHC: No SVHC; Lead Free: Lead Free
C4-C8 C10 C11 C15 = GRM155R71C104KA88D: 0402 0.1 uF 16V ±10 % Tolerance X7R SMT Multilayer Ceramic Capacitor; Manufacturer: Murata; Tolerance: 10%; Insulation Resistance: 10GR; Supplier 1: Digi-Key; Manufacturer Part Number: GRM155R71C104KA88D; RoHS: Yes; Category: Ceramic Capacitors; Stock 1: 30795639; Pricing 1: 1=0,10000, 10=0,02200, 50=0,01180, 100=0,00960, 500=0,00688, 1000=0,00541, 2500=0,00492, 5000=0,00452 (USD); Mount: Surface Mount; Case/Package: 0402; Number of Pins: 2; Case Code (Metric): 1005; Case Code (Imperial): 0402; Material: Ceramic; Dielectric Material: Ceramic; Min Operating Temperature: -55°C; Max Operating Temperature: 125°C; Capacitance: 100nF; Dielectric: X7R; Voltage Rating: 16V; Packaging: Tape and Reel; Voltage Rating (DC): 16V; Package Quantity: 1; Termination: SMD/SMT; Voltage: 16V; Length: 1mm; Width: 0.5mm; Height: 0.5mm; Thickness: 0.022inch; Depth: 0.5mm; Radiation Hardening: No; REACH SVHC: No SVHC; Lead Free: Lead Free; RoHS Compliant: Yes; ComponentLink1URL: https://datasheet.ciiva.com/129/grm155r71c104ka88-01-129739.pdf?src-supplier=Digi-Key; ComponentLink1Description: https://datasheet.ciiva.com/129/grm155r71c104ka88-01-129739.pdf?src-supplier=Digi-Key; ComponentLink2URL: https://datasheet.ciiva.com/129/grm155r71c104ka88-01-129740.pdf?src-supplier=Digi-Key; ComponentLink2Description: https://datasheet.ciiva.com/129/grm155r71c104ka88-01-129740.pdf?src-supplier=Digi-Key; ComponentLink3URL: https://datasheet.ciiva.com/18102/getdatasheetpartid-85307-18102905.pdf?src-supplier=Verical; ComponentLink3Description: https://datasheet.ciiva.com/18102/getdatasheetpartid-85307-18102905.pdf?src-supplier=Verical; ComponentLink4URL: https://datasheet.ciiva.com/29199/454098-da-01-en-vs-kondensator-0402-29199799.pdf?src-supplier=Conrad; ComponentLink4Description: https://datasheet.ciiva.com/29199/454098-da-01-en-vs-kondensator-0402-29199799.pdf?src-supplier=Conrad; ComponentLink5URL: https://datasheet.ciiva.com/7937/4360-7937615.pdf?src-supplier=Element14; ComponentLink5Description: https://datasheet.ciiva.com/7937/4360-7937615.pdf?src-supplier=Element14; ComponentLink6URL: https://datasheet.ciiva.com/14116/grmseries-highdielectrictype-eng-14116878.pdf?src-supplier=Distrelec; ComponentLink6Description: https://datasheet.ciiva.com/14116/grmseries-highdielectrictype-eng-14116878.pdf?src-supplier=Distrelec; ComponentLink7URL: https://datasheet.ciiva.com/14103/grmseries-highdielectrictype-eng-14103750.pdf?src-supplier=Distrelec; ComponentLink7Description: https://datasheet.ciiva.com/14103/grmseries-highdielectrictype-eng-14103750.pdf?src-supplier=Distrelec; ComponentLink8URL: https://datasheet.ciiva.com/28534/4360-28534127.pdf?src-supplier=Element14; ComponentLink8Description: https://datasheet.ciiva.com/28534/4360-28534127.pdf?src-supplier=Element14; ComponentLink9URL: https://datasheet.ciiva.com/28534/4360-28534133.pdf?src-supplier=Element14; ComponentLink9Description: https://datasheet.ciiva.com/28534/4360-28534133.pdf?src-supplier=Element14; ComponentLink10URL: https://datasheet.ciiva.com/16199/product-16199000.pdf?src-supplier=Future+Electronics; ComponentLink10Description: https://datasheet.ciiva.com/16199/product-16199000.pdf?src-supplier=Future+Electronics; Supplier Part Number 1: 490-3261-1-ND
C12 C13 = 04025A120JAT2A: CAP CER 12PF 50V C0G/NP0 0402; Manufacturer: Kyocera AVX; Tolerance: 5%; Dielectric: C0G; Temperature Coefficient: 30ppm/°C; Insulation Resistance: 100GR; Supplier 1: Newark; Manufacturer Part Number: 04025A120JAT2A; RoHS: Yes; Category: Ceramic Capacitors; Mount: Surface Mount,PCB; Case/Package: 0402; Number of Pins: 2; Case Code (Metric): 1005; Case Code (Imperial): 0402; Min Operating Temperature: -55°C; Max Operating Temperature: 125°C; Packaging: Tape and Reel; Capacitance: 12pF; Voltage Rating: 50V; Voltage Rating (DC): 50V; Package Quantity: 1; Series: -; Termination: SMD/SMT; Construction: Flat; Voltage: 50V; Length: 1mm; Width: 0.02inch; Height: 0.5mm; Depth: 0.5mm; Thickness: 0.022inch; Radiation Hardening: No; Lead Free: Lead Free; RoHS Compliant: Yes; Reach SVHC Compliant: Yes; Supplier Part Number 1: 96M1132
C14 = C1005X5R1A225K050BC: TDK - C1005X5R1A225K050BC - COND, CERÁ MULT, X5R, 2.2UF, 10V, 0402; .PCBCheck: VMM; Supplier 1: Farnell; Manufacturer: TDK; Manufacturer Part Number: C1005X5R1A225K050BC; RoHS: YES; Stock 1: 13179; Pricing 1: 5=0.142, 300=0.0926, 1000=0.0836, 2500=0.0667, 5000=0.0564 (EUR); ComponentLink1URL: http://bcove.me/dwwzmldz; ComponentLink1Description: http://bcove.me/dwwzmldz; ComponentLink2URL: http://www.farnell.com/datasheets/1913358.pdf; ComponentLink2Description: http://www.farnell.com/datasheets/1913358.pdf; Supplier 2: Mouser; Supplier 3: Digi-Key; Supplier Part Number 1: 2346879; Supplier Part Number 2: 810-C1005X5R1A225K; Supplier Part Number 3: 445-7392-1-ND; .SCHCheck: VMM
D1 = BL-HB337A-AV-TRB: Blue 0402 1X.5X4MM; Manufacturer: American Bright; Lens Color: Colorless; Lens Style: Flat; Lens Transparency: Clear; Luminous Intensity: 35mcd; Forward Voltage: 2.8V; Test Current: 20mA; Viewing Angle: 120°; Dominant Wavelength: 571nm; Lens Size: 0.5mm; Manufacturer Part Number: BL-HB337A-AV-TRB; RoHS: Yes; Category: LEDs; Stock 1: 2065; Pricing 1: 1=0,35000, 10=0,27300, 100=0,12260, 500=0,11074, 1000=0,09097 (USD); Mount: Surface Mount; Case/Package: 0402; Color: Blue; Case Code (Imperial): 0402; Case Code (Metric): 1005; Packaging: Cut Tape; Length: 1mm; Width: 0.5mm; Height: 0.45mm; RoHS Compliant: Yes; ComponentLink1URL: http://www.americanbrightled.com/pdffiles/smt/BL-HGE37A-AV-TRB.pdf?src-supplier=Digi-Key; ComponentLink1Description: http://www.americanbrightled.com/pdffiles/smt/BL-HGE37A-AV-TRB.pdf?src-supplier=Digi-Key
D2 = BL-HUB37A-AV-TRB: Red 0402 1X.5X4MM; Manufacturer: American Bright; Lens Color: Colorless; Lens Style: Flat; Lens Transparency: Clear; Luminous Intensity: 35mcd; Forward Voltage: 2V; Test Current: 20mA; Viewing Angle: 120°; Dominant Wavelength: 571nm; Lens Size: 0.5mm; Manufacturer Part Number: BL-HUB37A-AV-TRB; RoHS: Yes; Category: LEDs; Stock 1: 2065; Pricing 1: 1=0,35000, 10=0,27300, 100=0,12260, 500=0,11074, 1000=0,09097 (USD); Mount: Surface Mount; Case/Package: 0402; Color: Red; Case Code (Imperial): 0402; Case Code (Metric): 1005; Packaging: Cut Tape; Length: 1mm; Width: 0.5mm; Height: 0.45mm; RoHS Compliant: Yes; ComponentLink1URL: http://www.americanbrightled.com/pdffiles/smt/BL-HGE37A-AV-TRB.pdf?src-supplier=Digi-Key; ComponentLink1Description: http://www.americanbrightled.com/pdffiles/smt/BL-HGE37A-AV-TRB.pdf?src-supplier=Digi-Key
J3 = NDS_CARDA: SymbolName_1: NDS_CONNECTOR; DeviceName: A; GateName_1: NDS_CARD; LibraryName: nds; DeviceSetName: NDS_CARD
J4 = PICO-DEVELOP-PORT: DSpico Development port; Manufacturer: LNH; Number of Positions: 6; Connector Type: Outer Shroud Contact; Voltage Rating: 3.3V; Gender: Male; Pitch: 2.54; Wire/Cable Gauge: 26AWG; Supplier 1: Farnell; Manufacturer Part Number: PICO-DEVELOP-PORT; Mount: Surface Mount; Min Operating Temperature: -25°C; Max Operating Temperature: 85°C; Number of Rows: 1; Termination: Solder; Fastening Type: Ramp; Current Rating: ?; Number of Contacts: 6; ComponentLink1URL: https://datasheet.ciiva.com/25617/0900766b810cef18-25617270.pdf; ComponentLink1Description: https://datasheet.ciiva.com/25617/0900766b810cef18-25617270.pdf; ComponentLink2URL: https://datasheet.ciiva.com/16379/jstsm03b-ghs-tb-lf-sn-16379590.pdf; ComponentLink2Description: https://datasheet.ciiva.com/16379/jstsm03b-ghs-tb-lf-sn-16379590.pdf; ComponentLink3URL: https://datasheet.ciiva.com/8052/5438-8052261.pdf; ComponentLink3Description: https://datasheet.ciiva.com/8052/5438-8052261.pdf
R3-R9 = CRCW040210K0FKED: VISHAY DRALORIC - CRCW040210K0FKED - RESISTENCIA, 10K, 0.063W, 1%, 0402, SMD; Resistance: 10kR; Temperature Coefficient: 100ppm/°C; Power Rating: 63mW; Voltage Rating: 50V; Supplier 1: Farnell; Supplier Part Number 1: 1469669; RoHS: Y-EX; Stock: 0; Pricing: 10=0.0147, 100=0.0113, 500=0.0091, 2500=0.007, 5000=0.0055 (GBP); ComponentLink1URL: http://www.farnell.com/datasheets/1720486.pdf; ComponentLink1Description: http://www.farnell.com/datasheets/1720486.pdf; ComponentLink2URL: http://www.farnell.com/cad/1551228.zip; ComponentLink2Description: http://www.farnell.com/cad/1551228.zip; .PCBCheck: *; .SCHCheck: *; Manufacturer: Vishay; Manufacturer Part Number: CRCW040210K0FKED; Mount: Surface Mount; Case/Package: 0402; Number of Pins: 2; Weight: 2.3E-05oz; Contact Plating: Tin; Case Code (Metric): 1005; Case Code (Imperial): 0402; Min Operating Temperature: -55°C; Max Operating Temperature: 155°C; Tolerance: 1%; Composition: Thick Film; Termination: SMD/SMT; Package Quantity: 10; Packaging: Tape and Reel; Military Standard: Not; Voltage Rating (DC): 50V; Number of Terminations: 2; Max Power Dissipation: 63mW; Features: Automotive AEC-Q200; Length: 1mm; Height: 0.35mm; Width: 0.02inch; Depth: 0.5mm; Radiation Hardening: No; Lead Free: Lead Free; REACH SVHC: Unknown; Supplier 2: RSComponents; Supplier 3: Mouser; Supplier 4: Digi-Key; Storage Location: C1-F2; Supplier Part Number 2: 6784697; Supplier Part Number 3: 71-CRCW0402-10K-E3; Supplier Part Number 4: 541-10.0KLTR-ND
R10 R11 = RC0402FR-0727RL: RES 27 OHM 1% 1/16W 0402; Package Height: 0.35mm; Rated Power Dissipation (P): 62.5mW; Rated Temperature: 70°C; Additional Feature: LASER TRIMMABLE; Resistance: 27R; Package Length: 1mm; Temperature Coefficient: 100ppm/°C; Package Width: 0.5mm; Working Voltage: 50V; JESD-609 Code: e3; Package Shape: Rectangular; Case/Package: 0402; Package Style: SMTMeter; Technology: METAL GLAZE/THICK FILM; Termination: Wraparound; Packaging: Tape and Reel; Resistor Type: FIXED RESISTOR; Max Operating Temperature: 155°C; Mount: Surface Mount; REACH SVHC: Yes; Terminal Finish: Nickel; Size Code: 0402; RoHS Compliant: Yes; Min Operating Temperature: -55°C; Tolerance: 1%; Construction: Chip; Number of Pins: 2
R12 = RC0402FR-07120RL: Res General Purpose Thick Film 0402 120 Ohm 1% 1/16W ±100ppm/°C Molded Paper T/R; Manufacturer: Yageo; Voltage Rating: 50V; Power Rating: 62.5mW; Max Power Dissipation: 63mW; Supplier 1: Farnell; Manufacturer Part Number: RC0402FR-07120RL; RoHS: Yes; Category: Chip SMD Resistors; Stock 1: 238785; Pricing 1: 10=0,0101, 100=0,0056, 500=0,0044, 2500=0,0032, 5000=0,0026, 10000=0,002, 50000=0,0019, 100000=0,0018 (EUR); Case/Package: 0402; Case Code (Imperial): 0402; Case Code (Metric): 1005; Min Operating Temperature: -55°C; Max Operating Temperature: 155°C; Packaging: Tape and Reel; Tolerance: 1%; Resistance: 120R; Resistor Type: Thick Film; Number of Terminations: 2; Termination: SMD/SMT; Temperature Coefficient: 100ppm/°C; Features: Moisture Resistant; Series: RC; Length: 0.039inch; Width: 0.02inch; Height: 0.016inch; Lead Free: 5697LeadFree; RoHS Compliant: Yes; ComponentLink1URL: https://datasheet.ciiva.com/12667/pyu-rc0402-51-rohs-l-6-r-12667958.pdf?src-supplier=Mouser; ComponentLink1Description: https://datasheet.ciiva.com/12667/pyu-rc0402-51-rohs-l-6-r-12667958.pdf?src-supplier=Mouser; Supplier Part Number 1: 9239120; Size Code: 0402; Package Quantity: 1; Resistance Tolerance: 1%; Construction: Rectangular; Technology: THICK FILM; Voltage Rating (AC): 50V; Depth: 0.5mm; Reach SVHC Compliant: No; Military Standard: Not; ComponentLink2URL: https://datasheet.ciiva.com/7849/1018594-7849831.pdf?src-supplier=Element14; ComponentLink2Description: https://datasheet.ciiva.com/7849/1018594-7849831.pdf?src-supplier=Element14; Value: 120R
R13 = RC0402FR-07220RL: SMD Chip Resistor, 220 Ohm, ± 1%, 62.5 mW, 0402 [1005 Metric], Thick Film, General Purpose; Manufacturer: Yageo; Voltage Rating: 50V; Power Rating: 62.5mW; Max Power Dissipation: 63mW; Temperature Coefficient: 100ppm/°C; Supplier 1: Farnell; Manufacturer Part Number: RC0402FR-07220RL; RoHS: Yes; Category: Chip SMD Resistors; Stock 1: 412549; Pricing 1: 10=0,0099, 100=0,0055, 500=0,0044, 2500=0,0032, 5000=0,0031 (EUR); Case/Package: 0402; Case Code (Imperial): 0402; Case Code (Metric): 1005; Min Operating Temperature: -55°C; Max Operating Temperature: 155°C; Packaging: Tape and Reel; Tolerance: 1%; Resistance: 220R; Resistor Type: Thick Film; Number of Terminations: 2; Termination: SMD/SMT; Features: Moisture Resistant; Series: RC; Length: 0.039inch; Width: 0.02inch; Height: 0.016inch; Lead Free: 5697LeadFree; RoHS Compliant: Yes; ComponentLink1URL: http://www.farnell.com/datasheets/2167052.pdf?src-supplier=Farnell; ComponentLink1Description: http://www.farnell.com/datasheets/2167052.pdf?src-supplier=Farnell; Supplier Part Number 1: 9239154; Number of Pins: 2; Size Code: 0402; Voltage Rating (DC): 50V; Package Quantity: 1; Resistance Tolerance: 1%; Construction: Rectangular; Technology: THICK FILM; Voltage Rating (AC): 50V; Depth: 0.5mm; Reach SVHC Compliant: No; Military Standard: Not; ComponentLink2URL: http://www.farnell.com/datasheets/1018594.pdf?src-supplier=Farnell; ComponentLink2Description: http://www.farnell.com/datasheets/1018594.pdf?src-supplier=Farnell; ComponentLink3URL: http://www.farnell.com/datasheets/1686128.pdf?src-supplier=Element14; ComponentLink3Description: http://www.farnell.com/datasheets/1686128.pdf?src-supplier=Element14; ComponentLink4URL: http://www.farnell.com/datasheets/2167052.pdf?src-supplier=Newark; ComponentLink4Description: http://www.farnell.com/datasheets/2167052.pdf?src-supplier=Newark; ComponentLink5URL: http://www.farnell.com/datasheets/2167052.pdf?src-supplier=Element14; ComponentLink5Description: http://www.farnell.com/datasheets/2167052.pdf?src-supplier=Element14; ComponentLink6URL: https://datasheet.octopart.com/RC0402FR-07220RL-Yageo-datasheet-10408619.pdf?src-supplier=Element14; ComponentLink6Description: https://datasheet.octopart.com/RC0402FR-07220RL-Yageo-datasheet-10408619.pdf?src-supplier=Element14; Value: 220R
R14 R15 = CRCW04021K00FKEDC: VISHAY - CRCW04021K00FKED - RES, PELÍC GRUESA, 1K, 1%, 0.063W, 0402; Resistencia: 1; Tensión Nominal: 50; Tipo de Resistencia: 0402 [Métrica 1005]; Potencia Nominal: 63; Rango de Producto: Serie AEC-Q200 CRCW; Encapsulado: Cinta Cortada; Tipo de Elemento Resistivo: Película Gruesa; Coeficiente de Temperatura: ± 100; Estándar de Certificación para Automoción: AEC-Q200; Nivel de Sensibilidad a la Humedad (MSL): MSL 1 - Ilimitado; Núm. de Contactos Macho: 2; Rango de Temperatura de Funcionamiento: -55°C a +155; Resistencia, Montaje: Dispositivo de Montaje Superficial (SMD); Temperatura de Trabajo Máx.: 155; Temperatura de Trabajo Mín.: -55°C<!--FANDB--><div class="features-and-benefits-container"><div class="features-and-benefits-description"><span class="features-benefits-value">The Vishay D/CRCW e3 series are standard thick film chip resistors. The resistance range includes E96 and E24 decade values from 1ohm to 10Mohm. CRCW e3 series resistors have a pure tin solder contacts on the Ni barrier layer that provides compatibility with reflow soldering process.</span></div><div class="features-and-benefits-list"><ul class="features-and-benefits-list-list"><li class="features-and-benefits-list-item">Automotive grade AEC-Q200 qualified</li><li class="features-and-benefits-list-item">EIA 0402, 0603, 0805, 1206, 1210, 1218, 2010, 2512 standard case sizes available</li><li class="features-and-benefits-list-item">Stability &Delta; Supplier 1: Farnell; Manufacturer: VISHAY; Manufacturer Part Number: CRCW04021K00FKED; RoHS: Y-EX; Stock 1: 83181; Pricing 1: 10=0,0125, 400=0,0097, 1000=0,0069, 2500=0,0057, 5000=0,0041 (EUR); Tolerancia de Resistencia: ± 1%; ComponentLink1URL: http://www.farnell.com/datasheets/2111203.pdf; ComponentLink1Description: http://www.farnell.com/datasheets/2111203.pdf; ComponentLink2URL: http://www.farnell.com/cad/1551424.zip; ComponentLink2Description: http://www.farnell.com/cad/1551424.zip; Supplier 2: Digi-Key; Supplier Part Number 1: 1469662; Supplier Part Number 2: 541-1.00KLCT-ND
S1 = SKTDLDE010: Switch Tactile N.O. SPST Rectangular Button Gull Wing 0.05A 12VDC 1.6N SMD T/R; Manufacturer: Alps Electric; Supplier 1: Rs; Manufacturer Part Number: SKTDLDE010; RoHS: Yes; Category: Tactile Switches; Stock 1: 500; Pricing 1: 10=0,90800, 50=0,83200, 100=0,80800, 250=0,78600, 500=0,76500 (EUR); RoHS Compliant: Yes; ComponentLink1URL: http://www.alps.com/products/WebObjects/catalog.woa/E/HTML/Tact/SurfaceMount/SKTD/SKTDLDE010.html?src-supplier=Mouser; ComponentLink1Description: http://www.alps.com/products/WebObjects/catalog.woa/E/HTML/Tact/SurfaceMount/SKTD/SKTDLDE010.html?src-supplier=Mouser; ComponentLink2URL: http://datasheet.octopart.com/SKTDLDE010-ALPS-datasheet-154833203.pdf?src-supplier=Rs; ComponentLink2Description: http://datasheet.octopart.com/SKTDLDE010-ALPS-datasheet-154833203.pdf?src-supplier=Rs
U2 = RP2040: RP2040 chip for Raspberry Pi Pico - ARM Cortex-M0+ MCU 32-Bit; Check_prices: https://www.snapeda.com/parts/RP2040/Raspberry+Pi/view-part/?ref=eda; Value: *; Availability: In Stock; MP: RP2040; Price: None; Package: None; SnapEDA_Link: https://www.snapeda.com/parts/RP2040/Raspberry+Pi/view-part/?ref=snap; Purchase-URL: https://pricing.snapeda.com/search/part/RP2040/?ref=eda; MF: Raspberry Pi
U3 = W25Q16JVUXIQ: NOR Flash Serial (SPI, Dual SPI, Quad SPI) 3V/3.3V 16M-bit 2M x 8 6ns 8-Pin USON EP T/R; MF: Winbond; Value: *; Purchase-URL: https://pricing.snapeda.com/search/part/W25Q16JVUXIQ/?ref=eda; Package: UFDFN-8 Winbond; Check_prices: https://www.snapeda.com/parts/W25Q16JVUXIQ/Winbond/view-part/?ref=eda; MP: W25Q16JVUXIQ; Price: None; SnapEDA_Link: https://www.snapeda.com/parts/W25Q16JVUXIQ/Winbond/view-part/?ref=snap; Availability: In Stock

## Nets that join several sheets
+3V3: [03] - POWER SUPPLY (Q1.2 Q2.2 R2.2), [04] - RP2040 (27 pins)
+3V3_BUS: [03] - POWER SUPPLY (6 pins), [04] - RP2040 (R15.1)
+3V3_DS: [03] - POWER SUPPLY (Q1.3), [04] - RP2040 (J3.8)
+VBUS: [03] - POWER SUPPLY (C1.2 U1.1 U1.3), [04] - RP2040 (J2.1)
GND: [03] - POWER SUPPLY (5 pins), [04] - RP2040 (37 pins)